# Altium schematic sheet CMIO4 PCB Stackup.SchDoc
size A4
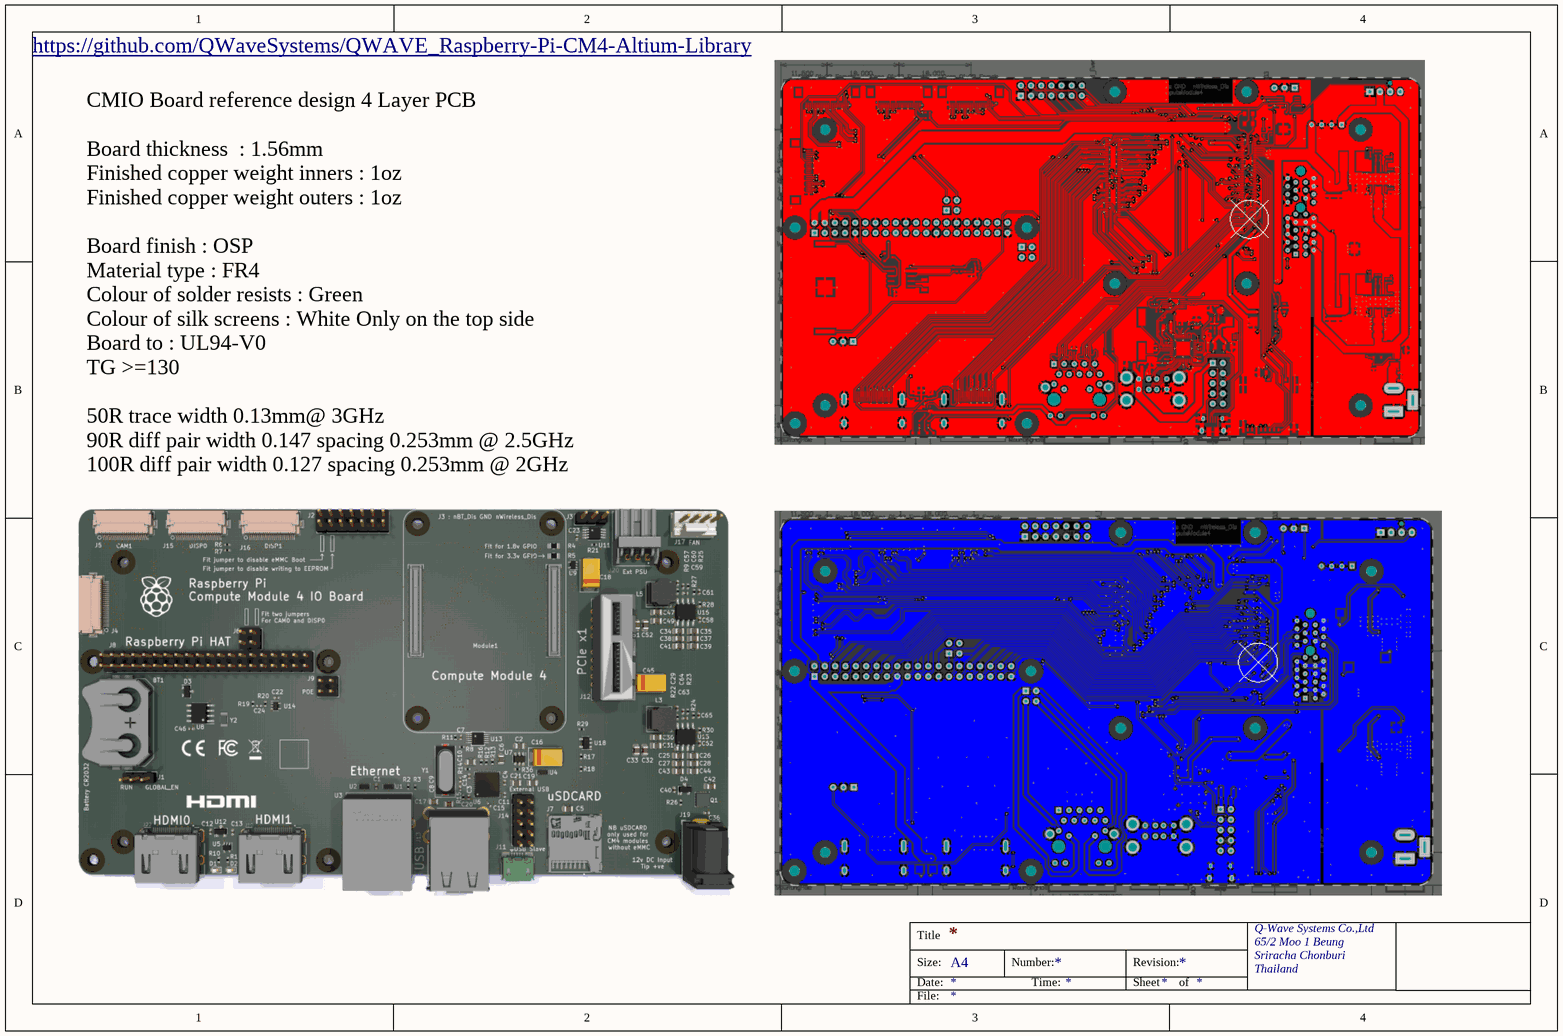
[diagram p0: CMIO4 PCB Stackup.SchDoc]

## Notes on the sheet
- https://github.com/QWaveSystems/QWAVE_Raspberry-Pi-CM4-Altium-Library
- CMIO Board reference design 4 Layer PCB
  Board thickness  : 1.56mm
  Finished copper weight inners : 1oz
  Finished copper weight outers : 1oz
  Board finish : OSP
  Material type : FR4
  Colour of solder resists : Green
  Colour of silk screens : White Only on the top side
  Board to : UL94-V0
  TG >=130
  50R trace width 0.13mm@ 3GHz
  90R diff pair width 0.147 spacing 0.253mm @ 2.5GHz
  100R diff pair width 0.127 spacing 0.253mm @ 2GHz
- Title
- Size:
- Date:
- A4
- Number:
- Time:
- Revision:
- Sheet
- of
- Q-Wave Systems Co.,Ltd
- 65/2 Moo 1 Beung
- Sriracha Chonburi
- Thailand
- File: